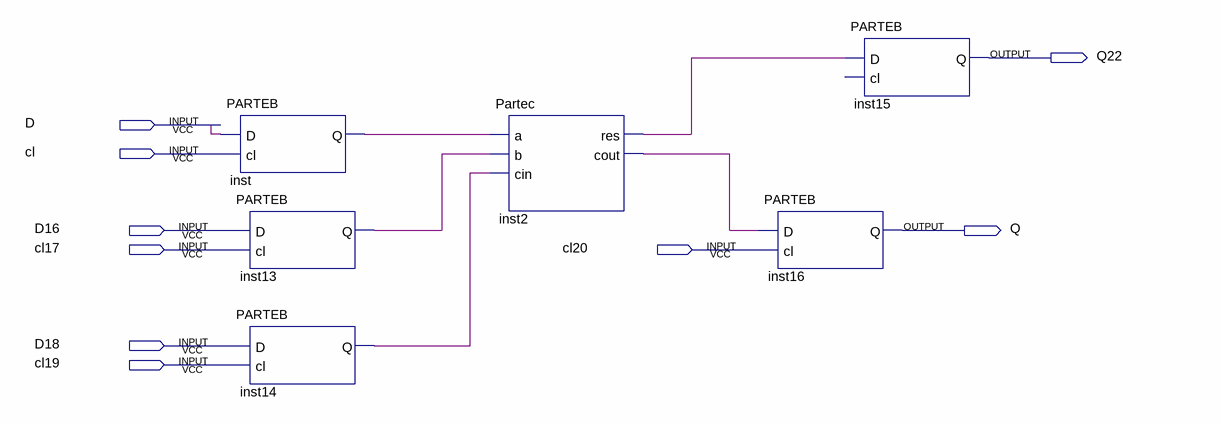
[diagram p0: schematic sheet]
// Quartus schematic Block1.bdf as structural Verilog: 6 symbols, 9 pins
module Block1 (
  input  D,
  input  cl,
  input  D16,
  input  cl17,
  input  cl20,
  input  D18,
  input  cl19,
  output Q22,
  output Q
);

  wire inst2_cout, inst2_res, inst13_q, inst14_q, inst_q;

  PARTEB inst (.D(D), .cl(cl), .Q(inst_q));
  PARTEB inst13 (.D(D16), .cl(cl17), .Q(inst13_q));
  PARTEB inst14 (.D(D18), .cl(cl19), .Q(inst14_q));
  Partec inst2 (.a(inst_q), .b(inst13_q), .cin(inst14_q), .res(inst2_res), .cout(inst2_cout));
  PARTEB inst16 (.D(inst2_cout), .cl(cl20), .Q(Q));
  PARTEB inst15 (.D(inst2_res), .Q(Q22));  // open: cl
endmodule
